# Altium schematic sheet 03_Schematic.SchDoc
size A4; Date: 19/03/2023; CheckedBy: YenDoo; DrawnBy: Hnit; DocumentNumber: 03; Revision: 01; SheetNumber: 3; SheetTotal: 3; Time: 00:00:00
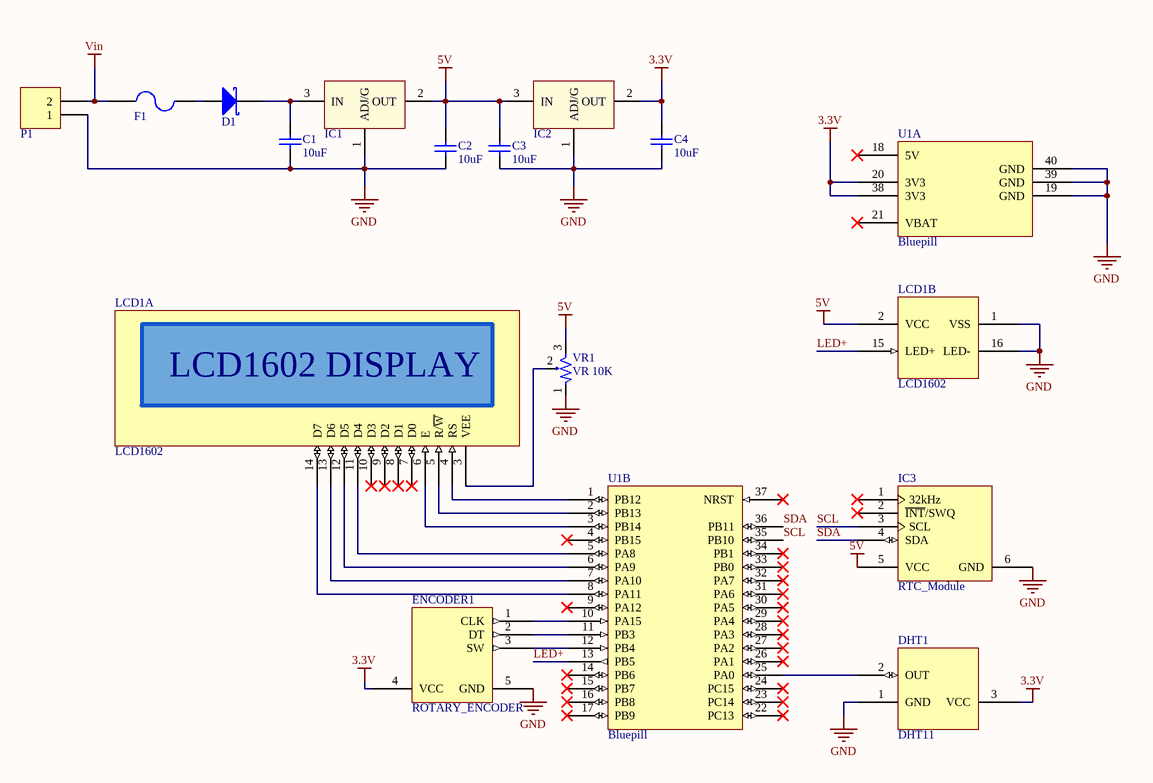
[diagram p0: 03_Schematic.SchDoc]

## Parts
C1  value 10uF  [CAP-SM-0805]  (hidden comment: Cap Non-Pol SMD)
C2  value 10uF  [CAP-SM-0805]  (hidden comment: Cap Non-Pol SMD)
C3  value 10uF  [CAP-SM-0805]  (hidden comment: Cap Non-Pol SMD)
C4  value 10uF  [CAP-SM-0805]  (hidden comment: Cap Non-Pol SMD)
D1  D Schottky  [SS34]  (value not drawn)
DHT1  DHT11  [DHT11]
ENCODER1  ROTARY_ENCODER  [ROTARY_ENCODER]
F1  Fuse  [FUSE SMD]  (value not drawn)
IC1  LM1117  [SOT223-4N]  (value not drawn)
IC2  LM1117  [SOT223-4N]  (value not drawn)
IC3  RTC_Module  [DS3231_PINOUT_Module]
LCD1  LCD1602  [LCD1602]  (parts A,B of 2)
P1  Domino 2  [DOMINO SMALL 2]  (value not drawn)
U1  Bluepill  [STM32F103C8T6_PINOUT_Bluepill]  (parts A,B of 2)
VR1  value VR 10K  [Varistor 1]  (hidden comment: 10K)

## Nets
3.3V: C4.2 DHT1.3(VCC) ENCODER1.4(VCC) IC2.2(OUT) U1.20(3V3) U1.38(3V3)
5V: C2.2 C3.2 IC1.2(OUT) IC2.3(IN) IC3.5(VCC) LCD1.2(VCC) VR1.3
GND: C1.1 C2.1 C3.1 C4.1 DHT1.1(GND) ENCODER1.5(GND) IC1.1(ADJ/G) IC2.1(ADJ/G) IC3.6(GND) LCD1.1(VSS) LCD1.16(LED-) P1.1 U1.19(GND) U1.39(GND) U1.40(GND) VR1.1
Vin: F1.1 P1.2
LED+: LCD1.15(LED+) U1.13(PB5)
SCL: IC3.3(SCL) U1.35(PB10)
SDA: IC3.4(SDA) U1.36(PB11)
NetC1_2: C1.2 D1.2(K) IC1.3(IN)
NetD1_1: D1.1(A) F1.2
NetDHT1_2: DHT1.2(OUT) U1.25(PA0)
NetENCODER1_1: ENCODER1.1(CLK) U1.10(PA15)
NetENCODER1_2: ENCODER1.2(DT) U1.11(PB3)
NetENCODER1_3: ENCODER1.3(SW) U1.12(PB4)
NetLCD1_3: LCD1.3(VEE) VR1.2
NetLCD1_4: LCD1.4(RS) U1.1(PB12)
NetLCD1_5: LCD1.5(R/~{W}) U1.2(PB13)
NetLCD1_6: LCD1.6(E) U1.3(PB14)
NetLCD1_11: LCD1.11(D4) U1.5(PA8)
NetLCD1_12: LCD1.12(D5) U1.6(PA9)
NetLCD1_13: LCD1.13(D6) U1.7(PA10)
NetLCD1_14: LCD1.14(D7) U1.8(PA11)

Not connected (* = marked no-connect by the designer): IC3 1(32kHz)* 2(~{INT}/SWQ)*; LCD1 7(D0)* 8(D1)* 9(D2)* 10(D3)*; U1 4(PB15)* 9(PA12)* 14(PB6)* 15(PB7)* 16(PB8)* 17(PB9)* 18(5V)* 21(VBAT)* 22(PC13)* 23(PC14)* 24(PC15)* 26(PA1)* 27(PA2)* 28(PA3)* 29(PA4)* 30(PA5)* 31(PA6)* 32(PA7)* 33(PB0)* 34(PB1)* 37(NRST)*

## Notes on the sheet
- Title
- Size
- Number
- Revision
- Date
- Draw by:
- A4
- Check by:
- Time
- File:
- (in symbol LCD1602, part A) LCD1602 DISPLAY

## Library data of the parts
C1-C4 = Cap Non-Pol SMD: Capacitor
D1 = D Schottky: Schottky Diode; Published: 8-Jun-2000; LatestRevisionDate: 17-Jul-2002; LatestRevisionNote: Re-released for DXP Platform.; PackageReference: SMB; Publisher: Altium Limited; PackageDescription: DO-214-AA/SMB; 2 C-Bend Leads; Body 5.3 x 3.6 mm, inc. leads (LxW); Code_JEDEC: DO-214-AA
DHT1 = DHT11: Temperature Humidity Sensor 16bi / Humidity, Temperature Digital ±5% RH Through Hole; Manufacturer: UNIVERSAL-SOLDER Electronics Ltd; Output: 16b; Accuracy: ±5% RH; Voltage - Supply: 3.5V ~ 5.5V; Sensor Type: Humidity, Temperature; Output Type: Digital; Mounting Type: Through Hole; ComponentLink1Description: Produdct (hshop.vn); ComponentLink1URL: https://hshop.vn/products/cam-bien-do-am-nhiet-do-dht11-ra-chan; ComponentLink2Description: Product (digikey.com); ComponentLink2URL: https://www.digikey.com/en/products/detail/universal-solder-electronics-ltd/DHT11/16822119; ComponentLink3Description: Datasheet (UNIVERSAL-SOLDER Electronics Ltd); ComponentLink3URL: https://universal-solder.ca/downloads/DHT11.pdf; ComponentLink4Description: Datasheet (Adafruit Industries); ComponentLink4URL: http://www.mediafire.com/download/48g0861d7ch3l34/dht_document.pdf
ENCODER1 = ROTARY_ENCODER: 4 Position Wire to Board Terminal Block Horizontal with Board 0.197" (5.00mm) Through Hole; Manufacturer: Amphenol Anytek; Manufacturer Product Number: TERM BLK 4POS SIDE ENTRY 5MM PCB; Number of Levels: 1; Positions Per Level: 4; Current: 15 A; Voltage: 300 V; Wire Gauge: 12-24 AWG; Base Product Number: KY04; ComponentLink1Description: Product (hshop.vn); ComponentLink1URL: https://hshop.vn/products/mach-volume-xoay-encoder; Series: KY; ComponentLink2Description: Datasheet (Amphenol Anytek); ComponentLink2URL: https://www.digikey.com/en/htmldatasheets/production/1664187/0/0/1/kyxx01x000j0g-drawing.html?site=US&lang=en&cur=USD; Pitch: 0.197" (5.00mm); Mating Orientation: Horizontal with Board; Mounting Type: Through Hole; Operating Temperature: -40°C ~ 115°C
IC1 IC2 = LM1117: Available in 1.8V, 2.5V, 2.85V, 3.3V, 5V, and  Adjustable Versions; Value: LM317
IC3 = DS3231: RTC MODULE CLK/CALENDAR I2C 16SOIC; Manufacturer: Seeed Technology Co., Ltd; Interface: I²C, 2-Wire Serial; Voltage - Supply: 2.3V ~ 5.5V; Current - Timekeeping (Max): 130µA ~ 200µA @ 3.63V ~ 5.5V; Type: Clock/Calendar; Features: Alarm, Leap Year, Square Wave Output; ComponentLink1Description: Datasheet (IC); ComponentLink1URL: https://www.analog.com/media/en/technical-documentation/data-sheets/DS3231M.pdf; Operating Temperature: -40°C ~ 85°C; ComponentLink2Description: Datasheet (Module); ComponentLink2URL: https://datasheets.maximintegrated.com/en/ds/DS3231.pdf; ComponentLink3Description: Product (hshop.vn); ComponentLink3URL: https://hshop.vn/products/mach-thoi-gian-thuc-rtc-ds3231
LCD1 = LCD1602: LCD1602, or 1602 character-type liquid crystal display, is a kind of dot matrix module to show letters, numbers, and characters and so on. It's composed of 5x7 or 5x11 dot matrix positions; each position can display one character; DISPLAY CONSTRUCTION: 16 Characters * 2 Lines; DISPLAY MODE: TN/STN; DISPLAY TYPE: Positive Transflective; BACKLIGHT: LED; VIEWING DIRECTION: 6 o'clock; DRIVING VOLTAGE: Single power; DRIVING METHOD: 1/16 duty,1/5 bias; NUMBER OF DATA LINE: 8-bit parallel; CONNECTOR: Pin / ZEBRA; DRIVER IC: KS0066 (compatible with HD44780); INTERFACE: Parallel; BACKLIGHT COLOR: GREEN/BLUE; CHARACTER COLOR: White; CHARACTER SET: ASCII; OPERATING TEMPERATURE: Indoor; TYPE: COB (Chip On Board); DIMENSION: 80 * 36 * 12.5; ComponentLink1Description: Hshop (Green Backlight); ComponentLink1URL: https://hshop.vn/products/lcd-text-lcd1602-xanh-lo; ComponentLink2Description: Hshop (Blue Backlight); ComponentLink2URL: https://hshop.vn/products/lcd-text-lcd1602-xanh-duong; ComponentLink3Description: Datasheet; ComponentLink3URL: https://www.waveshare.com/datasheet/LCD_en_PDF/LCD1602.pdf
P1 = Domino 2: Domino, 2-Pin; LatestRevisionDate: 17-Jul-2002; LatestRevisionNote: Re-released for DXP Platform.; Publisher: Altium Limited
U1 = STM32F103C8T6: STM32F103C8T6, mbed-Enabled Development Bluepill STM32F1 ARM® Cortex®-M3 MCU 32-Bit Embedded Evaluation Board; Manufacturer: STMicroelectronics; Core Size: 32-Bit Single-Core; Speed: 72MHz; Connectivity: CANbus, I²C, IrDA, LINbus, SPI, UART/USART, USB; Peripherals: DMA, Motor Control PWM, PDR, POR, PVD, PWM, Temp Sensor, WDT; Number of I/O: 37; Program Memory Size: 64KB (64K x 8); Program Memory Type: FLASH; RAM Size: 20K x 8; Voltage - Supply (Vcc/Vdd): 2V ~ 3.6V; Data Converters: A/D 10x12b; Oscillator Type: Internal; Category: Microcontrollers; Series: STM32F1; Core Processor: ARM® Cortex®-M3; EEPROM Size: -; Operating Temperature: -40°C ~ 85°C (TA); ComponentLink1Description: MPU; ComponentLink1URL: https://www.thegioiic.com/stm32f103c8t6; ComponentLink2Description: Kit Bluepill; ComponentLink2URL: https://hshop.vn/products/kit-ra-chon-stm32f103c8t6; ComponentLink3Description: Datasheet; ComponentLink3URL: https://www.st.com/resource/en/datasheet/cd00161566.pdf
VR1 = Var Resistor